# Altium schematic sheet MI_06_07_08_MCU_Rev_3_0.SchDoc
size A4 portrait
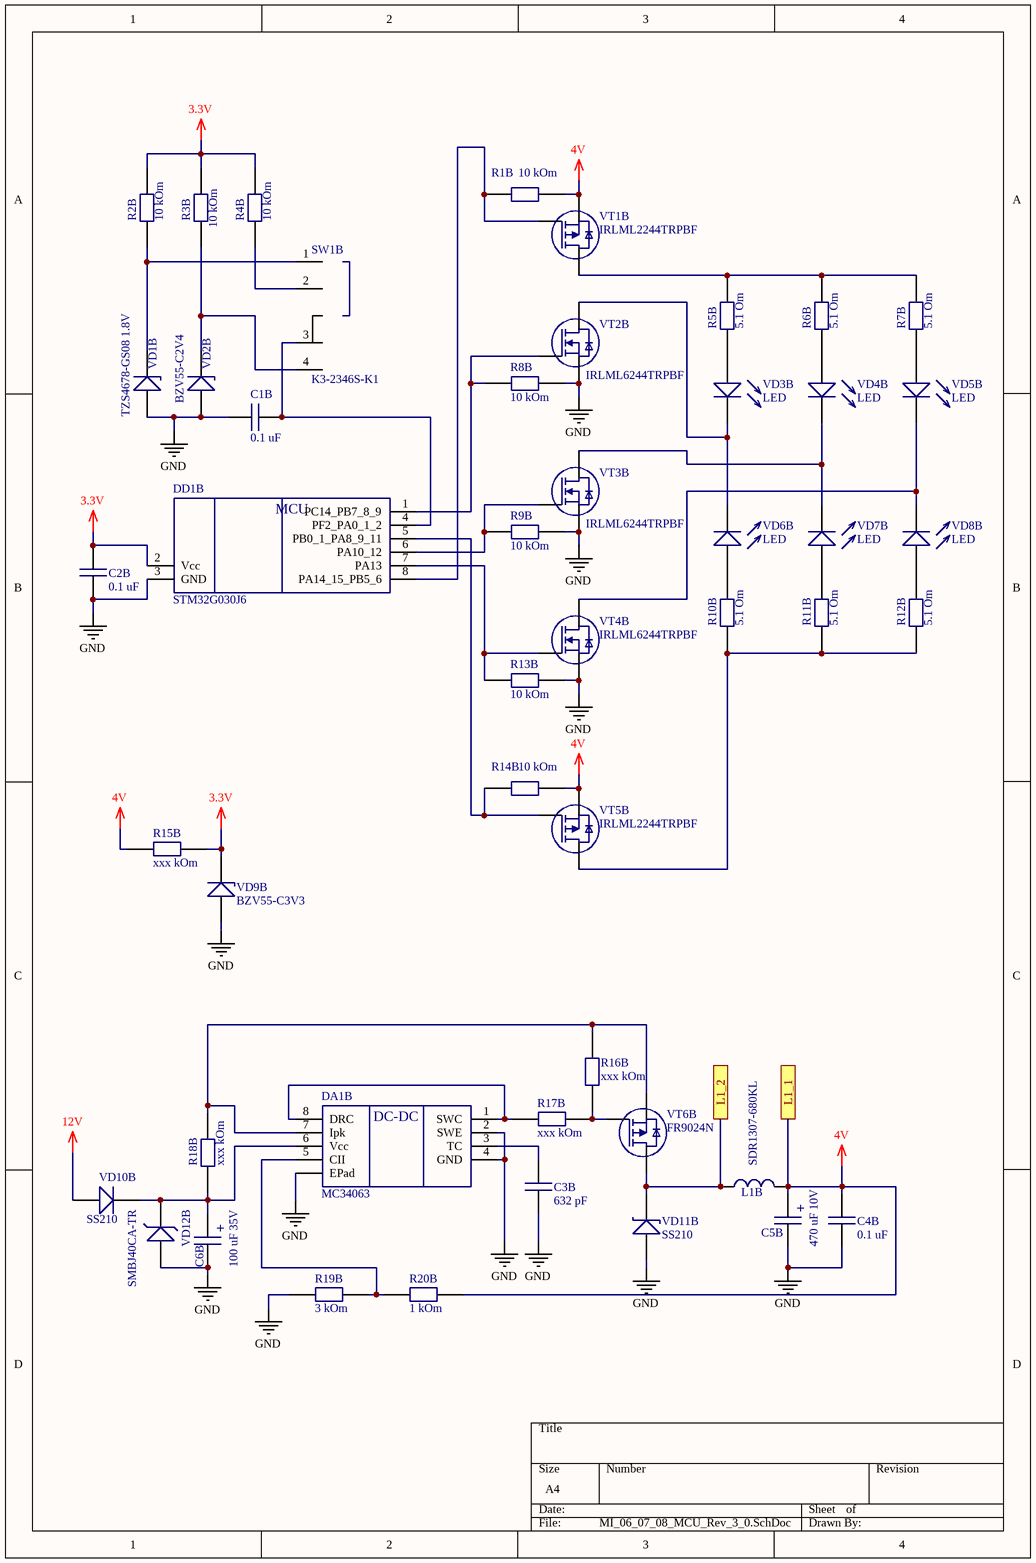
[diagram p0: MI_06_07_08_MCU_Rev_3_0.SchDoc]

## Parts
C1B  value 0.1 uF  [CAP1206]  (hidden comment: Capacitor)
C2B  value 0.1 uF  [CAP1206]  (hidden comment: Capacitor)
C3B  value 632 pF  [CAP1206]  (hidden comment: Capacitor)
C4B  value 0.1 uF  [CAP1206]  (hidden comment: Capacitor)
C5B  value 470 uF 10V  [CAP6.3x7.7]  (hidden comment: Capacitor_Polar)
C6B  value 100 uF 35V  [CAP6.3x7.7]  (hidden comment: Capacitor_Polar)
DA1B  MC34063  [SOIC-8-EPad]
DD1B  STM32G030J6  [SOIC-8]
L1B  value SDR1307-680KL  [SDR1307]  (hidden comment: coil)
R1B  value 10 kOm  [RES1206]  (hidden comment: Resistor)
R2B  value 10 kOm  [RES1206]  (hidden comment: Resistor)
R3B  value 10 kOm  [RES1206]  (hidden comment: Resistor)
R4B  value 10 kOm  [RES1206]  (hidden comment: Resistor)
R5B  value 5.1 Om  [RES1206]  (hidden comment: Resistor)
R6B  value 5.1 Om  [RES1206]  (hidden comment: Resistor)
R7B  value 5.1 Om  [RES1206]  (hidden comment: Resistor)
R8B  value 10 kOm  [RES1206]  (hidden comment: Resistor)
R9B  value 10 kOm  [RES1206]  (hidden comment: Resistor)
R10B  value 5.1 Om  [RES1206]  (hidden comment: Resistor)
R11B  value 5.1 Om  [RES1206]  (hidden comment: Resistor)
R12B  value 5.1 Om  [RES1206]  (hidden comment: Resistor)
R13B  value 10 kOm  [RES1206]  (hidden comment: Resistor)
R14B  value 10 kOm  [RES1206]  (hidden comment: Resistor)
R15B  value xxx kOm  [RES1206]  (hidden comment: Resistor)
R16B  value xxx kOm  [RES1206]  (hidden comment: Resistor)
R17B  value xxx kOm  [RES1206]  (hidden comment: Resistor)
R18B  value xxx kOm  [RES1206]  (hidden comment: Resistor)
R19B  value 3 kOm  [RES1206]  (hidden comment: Resistor)
R20B  value 1 kOm  [RES1206]  (hidden comment: Resistor)
SW1B  value K3-2346S-K1  [К3-2346S-K1]  (hidden comment: mks13c02)
VD1B  value TZS4678-GS08 1.8V  [minimelf]  (hidden comment: Zenner)
VD2B  value BZV55-C2V4  [minimelf]  (hidden comment: Zenner)
VD3B  LED  [LED_MAJAK2]
VD4B  LED  [LED_MAJAK2]
VD5B  LED  [LED_MAJAK2]
VD6B  LED  [LED_MAJAK2]
VD7B  LED  [LED_MAJAK2]
VD8B  LED  [LED_MAJAK2]
VD9B  value BZV55-C3V3  [minimelf]  (hidden comment: Zenner)
VD10B  value SS210  [SMB1]  (hidden comment: Diode)
VD11B  value SS210  [SMB1]  (hidden comment: Schottky)
VD12B  value SMBJ40CA-TR  [SMB1]  (hidden comment: Suppressor)
VT1B  value IRLML2244TRPBF  [SOT 23]  (hidden comment: MOSFET-P)
VT2B  value IRLML6244TRPBF  [SOT 23]  (hidden comment: MOSFET-N)
VT3B  value IRLML6244TRPBF  [SOT 23]  (hidden comment: MOSFET-N)
VT4B  value IRLML6244TRPBF  [SOT 23]  (hidden comment: MOSFET-N)
VT5B  value IRLML2244TRPBF  [SOT 23]  (hidden comment: MOSFET-P)
VT6B  value FR9024N  [D PAK]  (hidden comment: MOSFET-P)

## Ports
L1_1, L1_2

## Nets
3.3V: C2B.2 DD1B.2(Vcc) R2B.1 R3B.1 R4B.1 R15B.1 VD9B.1
4V: C4B.1 C5B.1 L1B.2 R1B.2 R14B.2 R15B.2 R20B.2 VT1B.S VT5B.S ; port L1_1
12V: VD10B.1
GND: C1B.2 C2B.1 C3B.2 C4B.2 C5B.2 C6B.2 DA1B.0(EPad) DA1B.2(SWE) DA1B.4(GND) DD1B.3(GND) R8B.2 R9B.2 R13B.2 R19B.2 VD1B.1 VD2B.1 VD9B.2 VD11B.2 VD12B.2 VT2B.S VT3B.S VT4B.S
L1_2: L1B.1 VD11B.1 VT6B.D ; port L1_2
NetC1B_1: C1B.1 DD1B.4(PF2_PA0_1_2) SW1B.3
NetC3B_1: C3B.1 DA1B.3(TC)
NetC6B_1: C6B.1 DA1B.6(Vcc) R18B.2 VD10B.3 VD12B.1
NetDA1B_1: DA1B.1(SWC) DA1B.8(DRC) R17B.2
NetDA1B_5: DA1B.5(CII) R19B.1 R20B.1
NetDA1B_7: DA1B.7(Ipk) R16B.1 R18B.1 VT6B.S
NetDD1B_1: DD1B.1(PC14_PB7_8_9) R8B.1 VT2B.G
NetDD1B_5: DD1B.5(PB0_1_PA8_9_11) R14B.1 VT5B.G
NetDD1B_6: DD1B.6(PA10_12) R9B.1 VT3B.G
NetDD1B_7: DD1B.7(PA13) R13B.1 VT4B.G
NetDD1B_8: DD1B.8(PA14_15_PB5_6) R1B.1 VT1B.G
NetR2B_2: R2B.2 SW1B.1 VD1B.3
NetR3B_2: R3B.2 SW1B.4 VD2B.3
NetR4B_2: R4B.2 SW1B.2
NetR5B_1: R5B.1 R6B.1 R7B.1 VT1B.D
NetR5B_2: R5B.2 VD3B.2
NetR6B_2: R6B.2 VD4B.2
NetR7B_2: R7B.2 VD5B.2
NetR10B_1: R10B.1 VD6B.2
NetR10B_2: R10B.2 R11B.2 R12B.2 VT5B.D
NetR11B_1: R11B.1 VD7B.2
NetR12B_1: R12B.1 VD8B.2
NetR16B_2: R16B.2 R17B.1 VT6B.G
NetVD3B_1: VD3B.1 VD6B.1 VT2B.D
NetVD4B_1: VD4B.1 VD7B.1 VT3B.D
NetVD5B_1: VD5B.1 VD8B.1 VT4B.D

## Notes on the sheet
- (in symbol Capacitor_Polar) +
- (in symbol MC34063) DC-DC
- (in symbol STM32G030J6) MCU

## Library data of the parts
VD1B VD2B = Zenner: pin to pad: 3>2
VD10B = Diode: pin to pad: 3>2
VT1B VT5B VT6B = MOSFET-P: pin to pad: D>2 G>1 S>3
VT2B VT3B VT4B = MOSFET-N: pin to pad: D>2 G>1 S>3
DA1B = MC34063: Value: MC34063
DD1B = STM32G030J6: Value: STM32G030J6
VD3B VD4B VD5B VD6B VD7B VD8B = LED: Value: LED